# EAGLE design avr-prog-adapter (EAGLE 6.5.0)
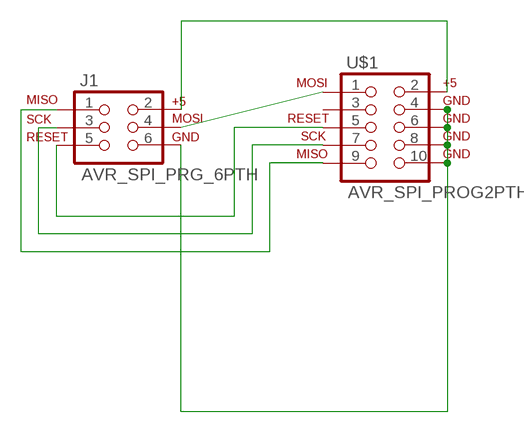
[diagram p0: schematic, sheet 1]

## Parts
J1  AVR_SPI_PRG_6PTH  [2X3]
U$1  AVR_SPI_PROG2PTH  [AVR_ICSP]

## Nets
N$1: J1.2 U$1.2
N$2: J1.6 U$1.4 U$1.6 U$1.8 U$1.10
N$3: J1.4 U$1.1
N$4: J1.5 U$1.5
N$5: J1.3 U$1.7
N$6: J1.1 U$1.9
Unconnected: U$1.3

## Library data of the parts
J1 = SparkFun-Connectors:AVR_SPI_PRG_6: AVR ISP 6 Pin This is the reduced ISP connector for AVR programming. Common on Arduino. This footprint will take up less PCB space and can be used with a 10-pin to 6-pin adapter such as SKU: BOB-08508
U$1 = SparkFun-Connectors:AVR_SPI_PROG2: AVR 10-pin ICSP Header This is the standard AVR In Circuit Serial Programming header. Minimal, but includes pin one indicator. Works with standard Olimex programmers. Also look for the 6-pin reduced version. Spark Fun Electronics SKU: PRT-00778

## Board
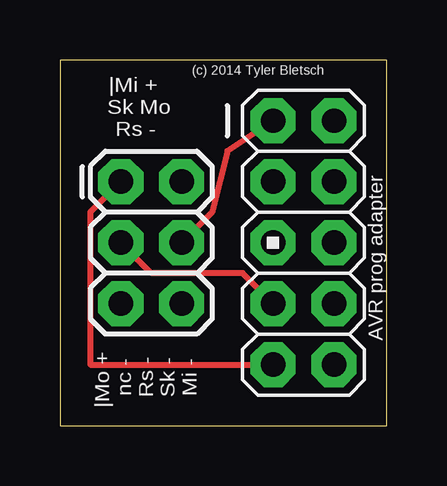
[diagram p1: board, top side]
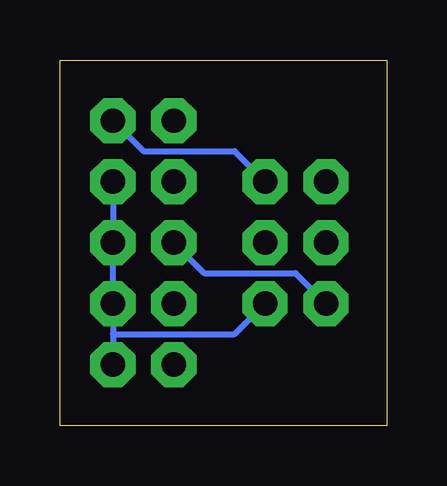
[diagram p2: board, bottom side, seen from below]

Size 13.64 x 15.23 mm. Coordinates in mm from the lower left corner, seen from the top.
Outline: 0,0 13.64,0 13.64,15.23 0,15.23 0,0
Copper layers (1*16): Top 0.035mm / dielectric 1.5mm / Bottom 0.035mm
Design rules "default": minimum track width 10mil, minimum drill 24mil, track to track 8mil, track to pad 8mil, pad to pad 8mil, via to via 8mil, smd to smd 8mil, copper to edge 40mil, drill to drill 8mil, minimum pad ring 10mil, minimum via ring 8mil, stop-mask expansion 4mil, vias tented up to drill 0mil, thermal gap 10mil

### Footprints (pad centres in the part's own frame; a part is rotated, then mirrored left to right if it is on the bottom)
2X3 = drill 1.016 pad 1.88 octagon: 1 0,0; 2 0,2.54; 3 2.54,0; 4 2.54,2.54; 5 5.08,0; 6 5.08,2.54
AVR_ICSP = drill 1.016 pad 1.88 octagon: 1 -1.27,5.08; 2 1.27,5.08; 3 -1.27,2.54; 4 1.27,2.54; 5 -1.27,0; 6 1.27,0; 7 -1.27,-2.54; 8 1.27,-2.54; 9 -1.27,-5.08; 10 1.27,-5.08

### Placement (x,y rotation side)
J1  2.54,10.16 270 top
U$1  10.16,7.62 0 top

### Tracks (layer width: path | path; a pad name or v marks a point on that pad's centre or on a via)
N$1
  Bottom 0.254: J1.2 6.35,11.43 10.16,11.43 U$1.2
N$2
  Bottom 0.254: U$1.4 U$1.6 U$1.8 11.43,3.81 | J1.6 6.35,3.81 11.43,3.81 | 11.43,3.81 U$1.10
N$3
  Top 0.254: J1.4 6.35,8.89 6.98,11.43 U$1.1
N$4
  Bottom 0.254: J1.5 3.81,6.35 7.62,6.35 U$1.5
N$5
  Top 0.254: J1.3 3.81,6.35 7.62,6.35 U$1.7
N$6
  Top 0.254: U$1.9 1.27,2.54 1.27,8.89 J1.1

### Text on the board
tPlace: (c) 2014 Tyler Bletsch | |Mi + / Sk Mo / Rs - | AVR prog adapter | |Mo + / nc - / Rs - / Sk - / Mi -